# Altium schematic sheet Sheet_1.schdoc
size 413 x 289 mm
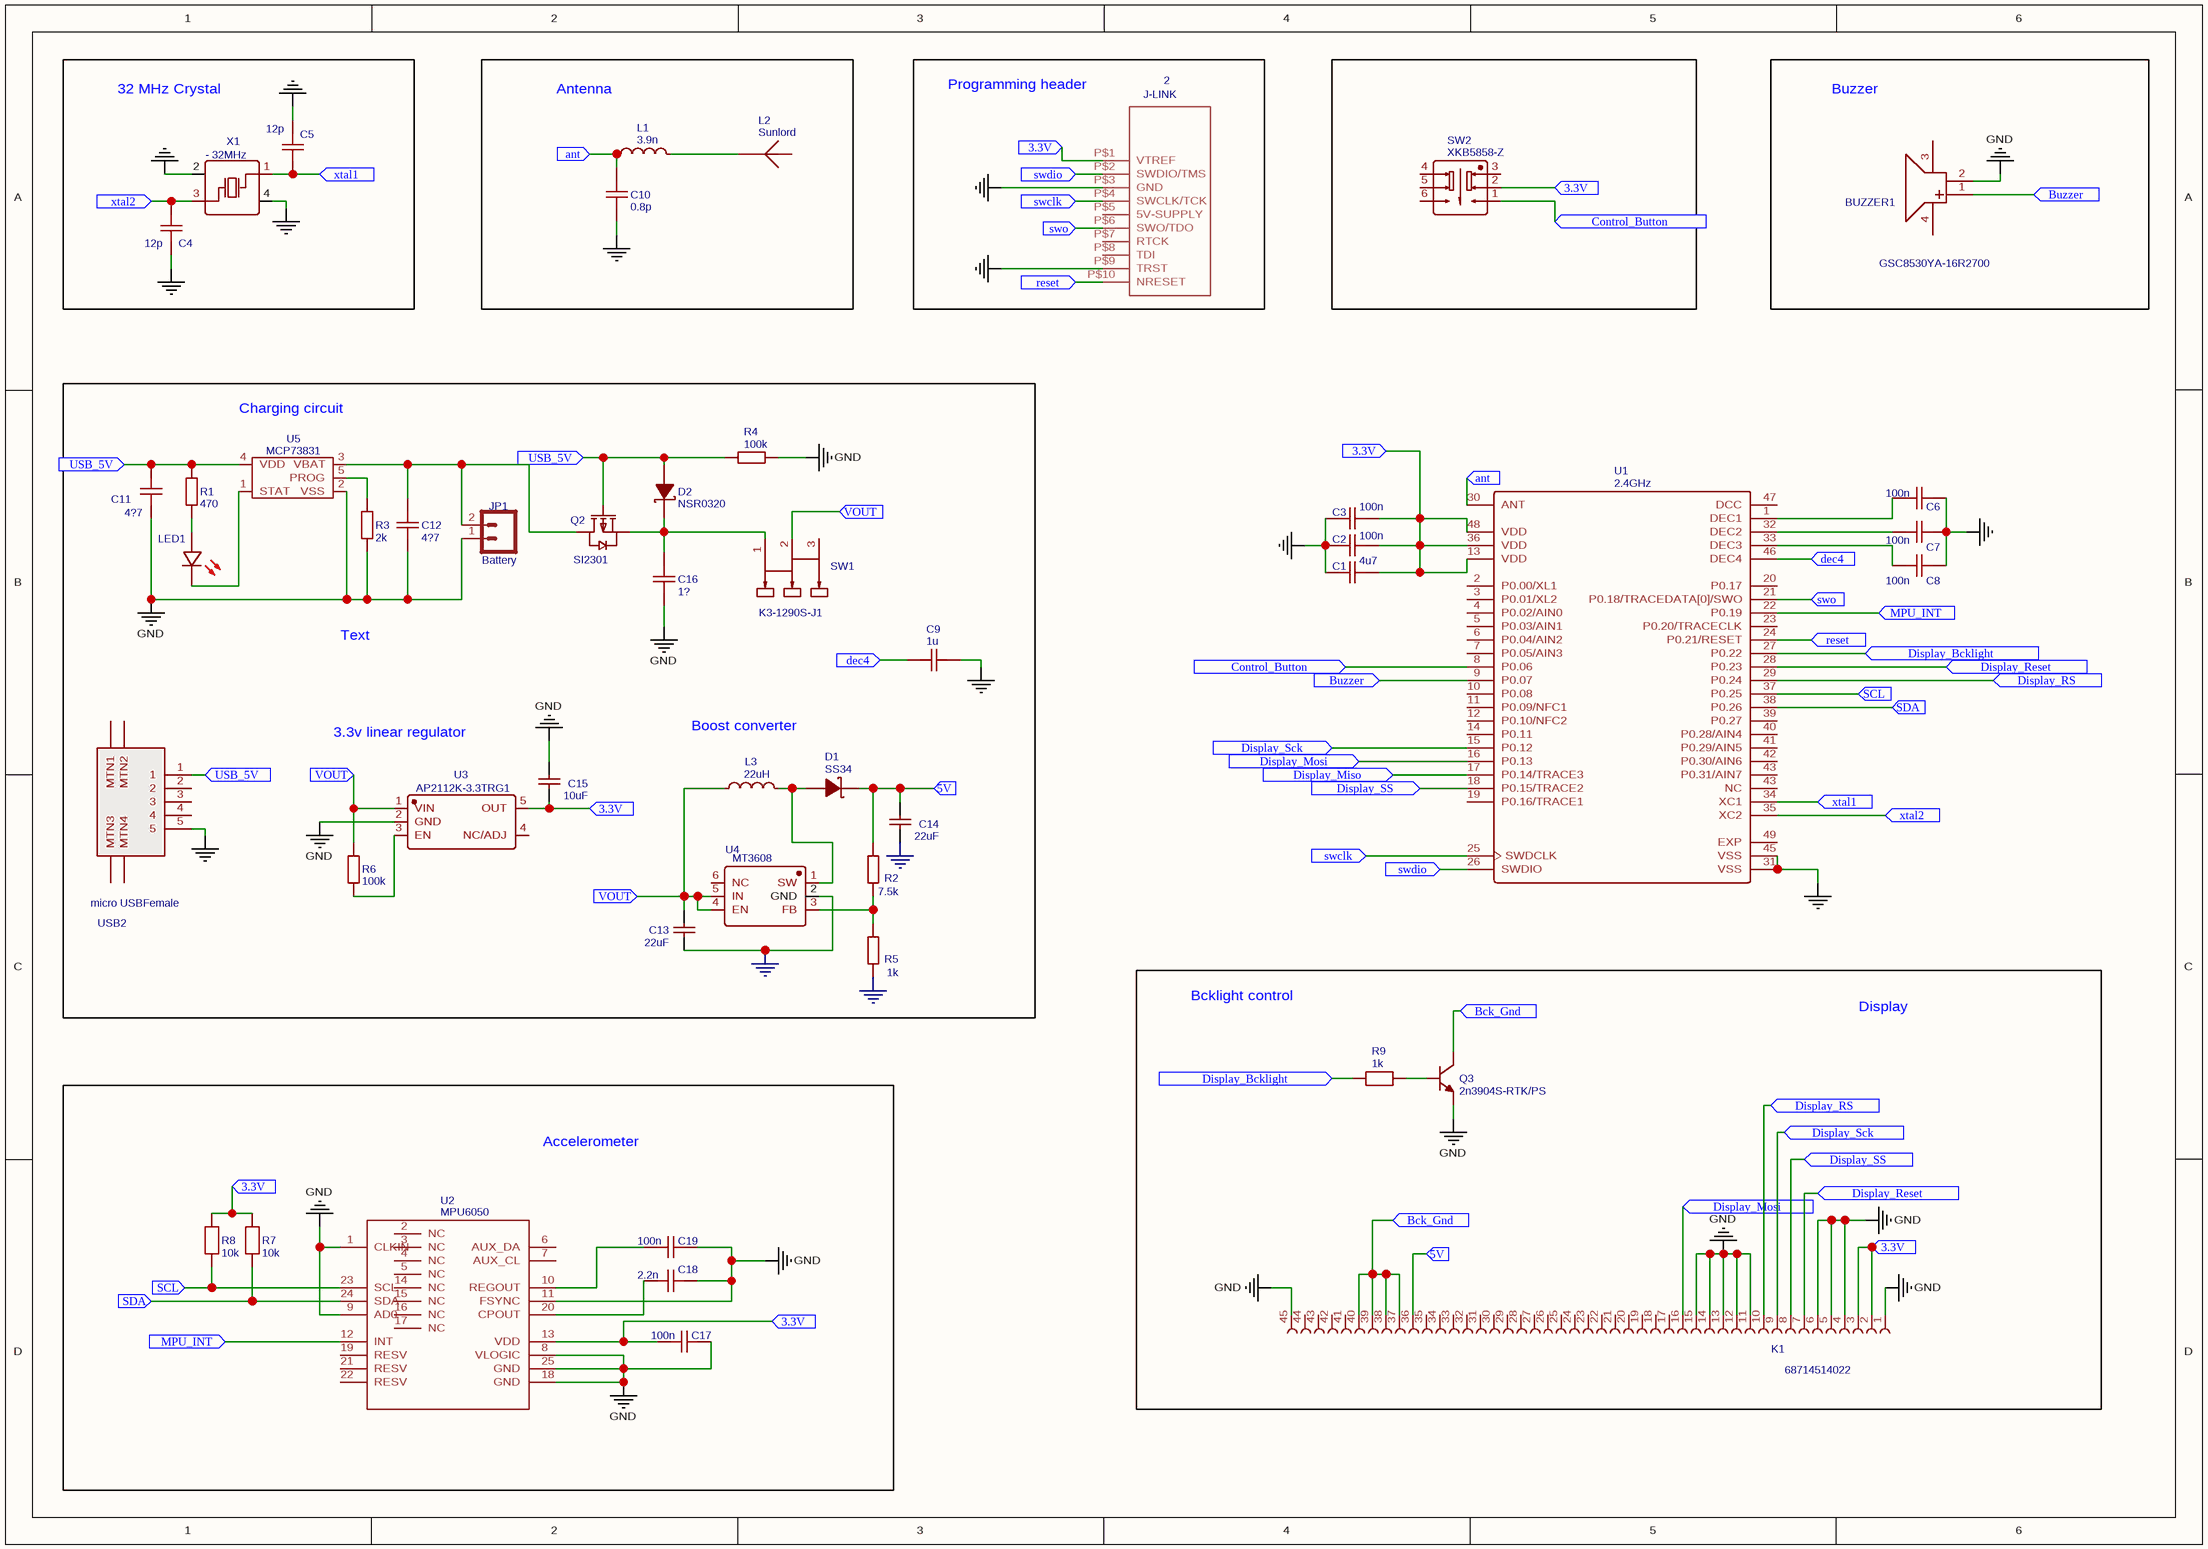
[diagram p0: Sheet_1.schdoc]

## Parts
2  J-LINK  [J-LINK_NEEDLE_ADAPTER]
BUZZER1  GSC8530YA-16R2700  [BUZZER-8.5X8.5-4P-SMD]
C1  4u7  [0402]
C2  100n  [0402]
C3  100n  [0402]
C4  12p  [0402]
C5  12p  [0402]
C6  100n  [0402]
C7  100n  [0402]
C8  100n  [0402]
C9  1u  [0402]
C10  0.8p  [0402]
C11  4?7  [0805]
C12  4?7  [0402]
C13  22uF  [0603]
C14  22uF  [0603]
C15  10uF  [0603]
C16  1?  [0805]
C17  100n  [0402]
C18  2.2n  [0402]
C19  100n  [0402]
D1  SS34  [SMA(DO-214AC)]
D2  NSR0320  [SOD-323]
JP1  Battery  [JST-2-SMD]
K1  68714514022  [68714514022]
L1  3.9n  [0603]
L2  Sunlord  [ANT-SMD2P-5.2X2.1]
L3  22uH  [7*7*4]
LED1  charge  [LED_0805]  (value not drawn)
Q2  SI2301  [SOT-23 323]
Q3  2n3904S-RTK/PS  [SOT-23_1]
R1  470  [0402]
R2  7.5k  [0603]
R3  2k  [0402]
R4  100k  [0603]
R5  1k  [0402]
R6  100k  [0603]
R7  10k  [0402]
R8  10k  [0402]
R9  1k  [0402]
SW1  K3-1290S-J1  [K3-1290S-J1]
SW2  XKB5858-Z  [SW-DIP-5.8X5.8X10]
U1  2.4GHz  [QFN-48_6X6X04P]
U2  MPU6050  [QFN50P400X400X95-25T265X275N]
U3  AP2112K-3.3TRG1  [SOT-25]
U4  MT3608  [SOT-23-6]
U5  MCP73831  [SOT23-5]
USB2  micro USBFemale  [MICRO-USB-1]
X1  - 32MHz  [CRYSTAL-SMD-3225]

## Blocks framed on the sheet
32 MHz Crystal: C4 C5 X1
Antenna: C10 L1 L2
Programming header: 2
Buzzer: BUZZER1
Accelerometer: C17-C19 R7 R8 U2

## Ports
3.3V, 5V, ant, Bck_Gnd, Buzzer, Control_Button, dec4, Display_Bcklight, Display_Miso, Display_Mosi, Display_Reset, Display_RS, Display_Sck, Display_SS, MPU_INT, reset, SCL, SDA, swclk, swdio, swo, USB_5V, VOUT, xtal1, xtal2

## Nets
GND: 2.P$3(GND) 2.P$9(TRST) BUZZER1.2(-) C1.1 C2.1 C3.1 C4.1 C5.2 C6.1 C7.1 C8.1 C9.2 C10.1 C11.1 C12.1 C13.1 C14.2 C15.1 C16.1 C17.1 C18.1 C19.1 JP1.1 K1.1 K1.4 K1.5 K1.6 K1.11 K1.12 K1.13 K1.14 K1.15 K1.45 Q3.1(E) R3.1 R4.1 R5.1 U1.31(VSS) U1.45(VSS) U2.1(CLKIN) U2.8(VLOGIC) U2.9(AD0) U2.11(FSYNC) U2.18(GND) U2.25(GND) U3.2(GND) U4.2(GND) U5.2(VSS) USB2.5 X1.2(GND) X1.4(GND)
3.3V: 2.P$1(VTREF) C1.2 C2.2 C3.2 C15.2 C17.2 K1.2 K1.3 R7.2 R8.2 SW2.2 U1.13(VDD) U1.36(VDD) U1.48(VDD) U2.13(VDD) U3.5(OUT) ; port 3.3V
5V: C14.1 D1.2(K) K1.36 R2.2 ; port 5V
ant: C10.2 L1.1 U1.30(ANT) ; port ant
Bck_Gnd: K1.37 K1.38 K1.39 K1.40 Q3.3(C) ; port Bck_Gnd
Buzzer: BUZZER1.1(+) U1.9(P0.07) ; port Buzzer
Control_Button: SW2.1 U1.8(P0.06) ; port Control_Button
dec4: C9.1 U1.46(DEC4) ; port dec4
Display_Bcklight: R9.1 U1.27(P0.22) ; port Display_Bcklight
Display_Miso: U1.17(P0.14/TRACE3) ; port Display_Miso
Display_Mosi: K1.16 U1.16(P0.13) ; port Display_Mosi
Display_Reset: K1.7 U1.28(P0.23) ; port Display_Reset
Display_RS: K1.10 U1.29(P0.24) ; port Display_RS
Display_Sck: K1.9 U1.15(P0.12) ; port Display_Sck
Display_SS: K1.8 U1.18(P0.15/TRACE2) ; port Display_SS
MPU_INT: U1.22(P0.19) U2.12(INT) ; port MPU_INT
reset: 2.P$10(NRESET) U1.24(P0.21/RESET) ; port reset
SCL: R8.1 U1.37(P0.25) U2.23(SCL) ; port SCL
SDA: R7.1 U1.38(P0.26) U2.24(SDA) ; port SDA
swclk: 2.P$4(SWCLK/TCK) U1.25(SWDCLK) ; port swclk
swdio: 2.P$2(SWDIO/TMS) U1.26(SWDIO) ; port swdio
swo: 2.P$6(SWO/TDO) U1.21(P0.18/TRACEDATA[0]/SWO) ; port swo
USB_5V: C11.2 D2.1(A) Q2.1(G) R1.2 R4.2 U5.4(VDD) USB2.1 ; port USB_5V
VOUT: C13.2 L3.1 R6.1 SW1.2 U3.1(VIN) U4.4(EN) U4.5(IN) ; port VOUT
xtal1: C5.1 U1.34(XC1) X1.1(OSC1) ; port xtal1
xtal2: C4.2 U1.35(XC2) X1.3(OSC2) ; port xtal2
NetC6_2: C6.2 U1.1(DEC1)
NetC7_2: C7.2 U1.32(DEC2)
NetC8_2: C8.2 U1.33(DEC3)
NetC12_2: C12.2 JP1.2 Q2.3(D) U5.3(VBAT)
NetC16_2: C16.2 D2.2(K) Q2.2(S) SW1.1
NetC18_2: C18.2 U2.20(CPOUT)
NetC19_2: C19.2 U2.10(REGOUT)
NetD1_1: D1.1(A) L3.2 U4.1(SW)
NetL1_2: L1.2 L2.ANT
NetLED1_1: LED1.1(+) R1.1
NetLED1_2: LED1.2(-) U5.1(STAT)
NetQ3_2: Q3.2(B) R9.2
NetR2_1: R2.1 R5.2 U4.3(FB)
NetR3_2: R3.2 U5.5(PROG)
NetR6_2: R6.2 U3.3(EN)

Not connected (* = marked no-connect by the designer): 2 P$5(5V-SUPPLY) P$7(RTCK) P$8(TDI); BUZZER1 3 4; K1 17 18 19 20 21 22 23 24 25 26 27 28 29 30 31 32 33 34 35 41 42 43 44; L2 2; SW1 3; SW2 3 4 5 6; U1 2(P0.00/XL1) 3(P0.01/XL2) 4(P0.02/AIN0) 5(P0.03/AIN1) 6(P0.04/AIN2) 7(P0.05/AIN3) 10(P0.08) 11(P0.09/NFC1) 12(P0.10/NFC2) 14(P0.11) 19(P0.16/TRACE1) 20(P0.17) 23(P0.20/TRACECLK) 39(P0.27) 40(P0.28/AIN4) 41(P0.29/AIN5) 42(P0.30/AIN6) 43(P0.31/AIN7) 47(DCC) 49(EXP); U2 2(NC) 3(NC) 4(NC) 5(NC) 6(AUX_DA) 7(AUX_CL) 14(NC) 15(NC) 16(NC) 17(NC) 19(RESV) 21(RESV) 22(RESV); U3 4(NC/ADJ); U4 6(NC); USB2 0(MTN4) 2 3 4

## Notes on the sheet
- (near U5) Charging circuit
- Text
- 3.3v linear regulator
- Boost converter
- Bcklight control
- Display

## Library data of the parts
2 = J-LINK: Contributor: Andrew Da\'Casto; BOM_Manufacturer Part: ?; spicePre: ?
BUZZER1 = GSC8530YA-16R2700: BOM_Manufacturer: INGHAi; Contributor: LCSC; BOM_Supplier: LCSC; BOM_Supplier Part: C255316; BOM_Manufacturer Part: GSC8530YA-16R2700; spicePre: B
C1 = 4u7: nameAlias: Value(F); BOM_Manufacturer Part: ?; spicePre: C; spiceSymbolName: Cap_RAD-0.1_US
C2 C3 C6-C8 C17 C19 = 100n: nameAlias: Value(F); BOM_Manufacturer Part: ?; spicePre: C; spiceSymbolName: Cap_RAD-0.1_US
C4 C5 = 12p: nameAlias: Value(F); BOM_Manufacturer Part: ?; spicePre: C; spiceSymbolName: Cap_RAD-0.1_US
C9 = 1u: nameAlias: Value(F); BOM_Manufacturer Part: ?; spicePre: C; spiceSymbolName: Cap_RAD-0.1_US
C10 = 0.8p: nameAlias: Value(F); BOM_Manufacturer Part: ?; spicePre: C; spiceSymbolName: Cap_RAD-0.1_US
C11 C12 = 4?7: nameAlias: Value(F); BOM_Manufacturer Part: ?; spicePre: C; spiceSymbolName: Cap_0805_US
C13 C14 = 22uF: BOM_Manufacturer: FH; BOM_Manufacturer Part: 1812X226K250NT; Voltage: 25V; Tolerance: ±10%; Value: 22uF; BOM_Supplier: LCSC; spicePre: C; BOM_Supplier Part: C28504
C15 = 10uF: BOM_Manufacturer: FH; BOM_Manufacturer Part: 1812X226K250NT; Value: 22uF; Voltage: 25V; Tolerance: ±10%; BOM_Supplier: LCSC; spicePre: C; BOM_Supplier Part: C28504
C16 = 1?: nameAlias: Value(F); BOM_Manufacturer Part: ?; spicePre: C; spiceSymbolName: Cap_0805_US
C18 = 2.2n: nameAlias: Value(F); BOM_Manufacturer Part: ?; spicePre: C; spiceSymbolName: Cap_RAD-0.1_US
D2 = NSR0320: nameAlias: Model; BOM_Manufacturer Part: ?; spicePre: D; spiceSymbolName: Schottky
JP1 = Battery: Contributor: SparkFun; BOM_Manufacturer Part: ?; spicePre: J
K1 = 68714514022: description: WR-FPC 0.5mm SMT ZIF Horizontal Top Contact, 45 Pins=Code : Con_FPC_ZIF_0.50_68714514022; timeStamp: 1476441403; BOM_Manufacturer Part: ?; spicePre: K
L1 = 3.9n: nameAlias: Value(H); BOM_Manufacturer Part: ?; spicePre: L; spiceSymbolName: Inductor_AXIAL-0.4_US
L2 = Sunlord: BOM_Manufacturer Part: SLDA52-2R540G-S1TF; nameAlias: Value; Contributor: LCSC; BOM_Supplier: LCSC; BOM_Supplier Part: C279814; BOM_Manufacturer: Sunlord; spicePre: L; spiceSymbolName: SLDA52-2R540G-S1TF
L3 = 22uH: BOM_Manufacturer: LCSC; BOM_Manufacturer Part: SMRH74-220MT; Value: 22uH; BOM_Supplier: LCSC; spicePre: L; BOM_Supplier Part: C27442
LED1 = charge: BOM_Manufacturer: Everlight Elec; BOM_Manufacturer Part: 17-21SURC/S530-A2/TR8; BOM_Supplier Part: C131244; BOM_Supplier: LCSC; spicePre: L
Q3 = 2n3904S-RTK/PS: BOM_Manufacturer: KEC; BOM_Supplier: LCSC; BOM_Manufacturer Part: 2n3904S-RTK/PS; image: //image.lceda.cn/szlcsc/C18536.jpg; BOM_Supplier Part: C18536; spicePre: Q
R1 = 470: nameAlias: Value(Ω); BOM_Manufacturer Part: ?; spicePre: R; spiceSymbolName: Res_0805(1/8W)_EU
R2 = 7.5k: nameAlias: Value(Ω); BOM_Manufacturer Part: ?; spicePre: R; spiceSymbolName: Resistor
R3 = 2k: nameAlias: Value(Ω); BOM_Manufacturer Part: ?; spicePre: R; spiceSymbolName: Res_0805(1/8W)_EU
R4 R6 = 100k: nameAlias: Value(Ω); BOM_Manufacturer Part: ?; spicePre: R; spiceSymbolName: Res_0805(1/8W)_EU
R5 R9 = 1k: nameAlias: Value(Ω); BOM_Manufacturer Part: ?; spicePre: R
  R5: spiceSymbolName: Resistor
  R9: spiceSymbolName: Res_AXIAL-0.3(1/8W)_EU
R7 R8 = 10k: nameAlias: Value(Ω); BOM_Manufacturer Part: ?; spicePre: R; spiceSymbolName: Res_AXIAL-0.3(1/8W)_EU
SW1 = K3-1290S-J1: BOM_Manufacturer: Korean Hroparts Elec; Contributor: LCSC; BOM_Supplier: LCSC; BOM_Supplier Part: C223846; BOM_Manufacturer Part: K3-1290S-J1; spicePre: S
SW2 = XKB5858-Z: BOM_Manufacturer: XKB Enterprise; Contributor: LCSC; BOM_Supplier: LCSC; BOM_Supplier Part: C318868; BOM_Manufacturer Part: XKB5858-Z; spicePre: S
U1 = 2.4GHz: BOM_Manufacturer: NORDIC; BOM_Manufacturer Part: NRF52832-QFAA-R; nameAlias: Frequency; BOM_Supplier: LCSC; BOM_Supplier Part: C77540; spicePre: U; spiceSymbolName: NRF52832-QFAA-R
U3 = AP2112K-3.3TRG1: BOM_Manufacturer: DIODES; Contributor: LCSC; BOM_Supplier: LCSC; BOM_Manufacturer Part: AP2112K-3.3TRG1; BOM_Supplier Part: C51118; spicePre: U
U4 = MT3608: BOM_Manufacturer: LCSC; BOM_Supplier: LCSC; BOM_Manufacturer Part: MT3608; spicePre: U; BOM_Supplier Part: C84817
U5 = MCP73831: Contributor: KiCad; BOM_Manufacturer Part: ?; spicePre: U
USB2 = micro USBFemale: BOM_Manufacturer: ValuePro; BOM_Supplier: LCSC; BOM_Manufacturer Part: micro USBFemale; image: //image.lceda.cn/szlcsc/C10418.jpg; BOM_Supplier Part: C10418; spicePre: U
X1 = - 32MHz: BOM_Manufacturer: KDS Daishinku; BOM_Manufacturer Part: 1XTV26000PEA; nameAlias: Frequency; Contributor: LCSC; BOM_Supplier: LCSC; BOM_Supplier Part: C253733; spicePre: X; spiceSymbolName: 1XTV26000PEA
D1 = SS34: BOM_Supplier: LCSC; BOM_Manufacturer Part: SS34; spicePre: D; BOM_Supplier Part: C8678
Q2 = SI2301: spicePre: Q
U2 = MPU6050: BOM_Manufacturer Part: ?; spicePre: U